# Altium schematic sheet Switch_RGB_Cherry.SchDoc
size A4; SheetNumber: 2; SheetTotal: 2
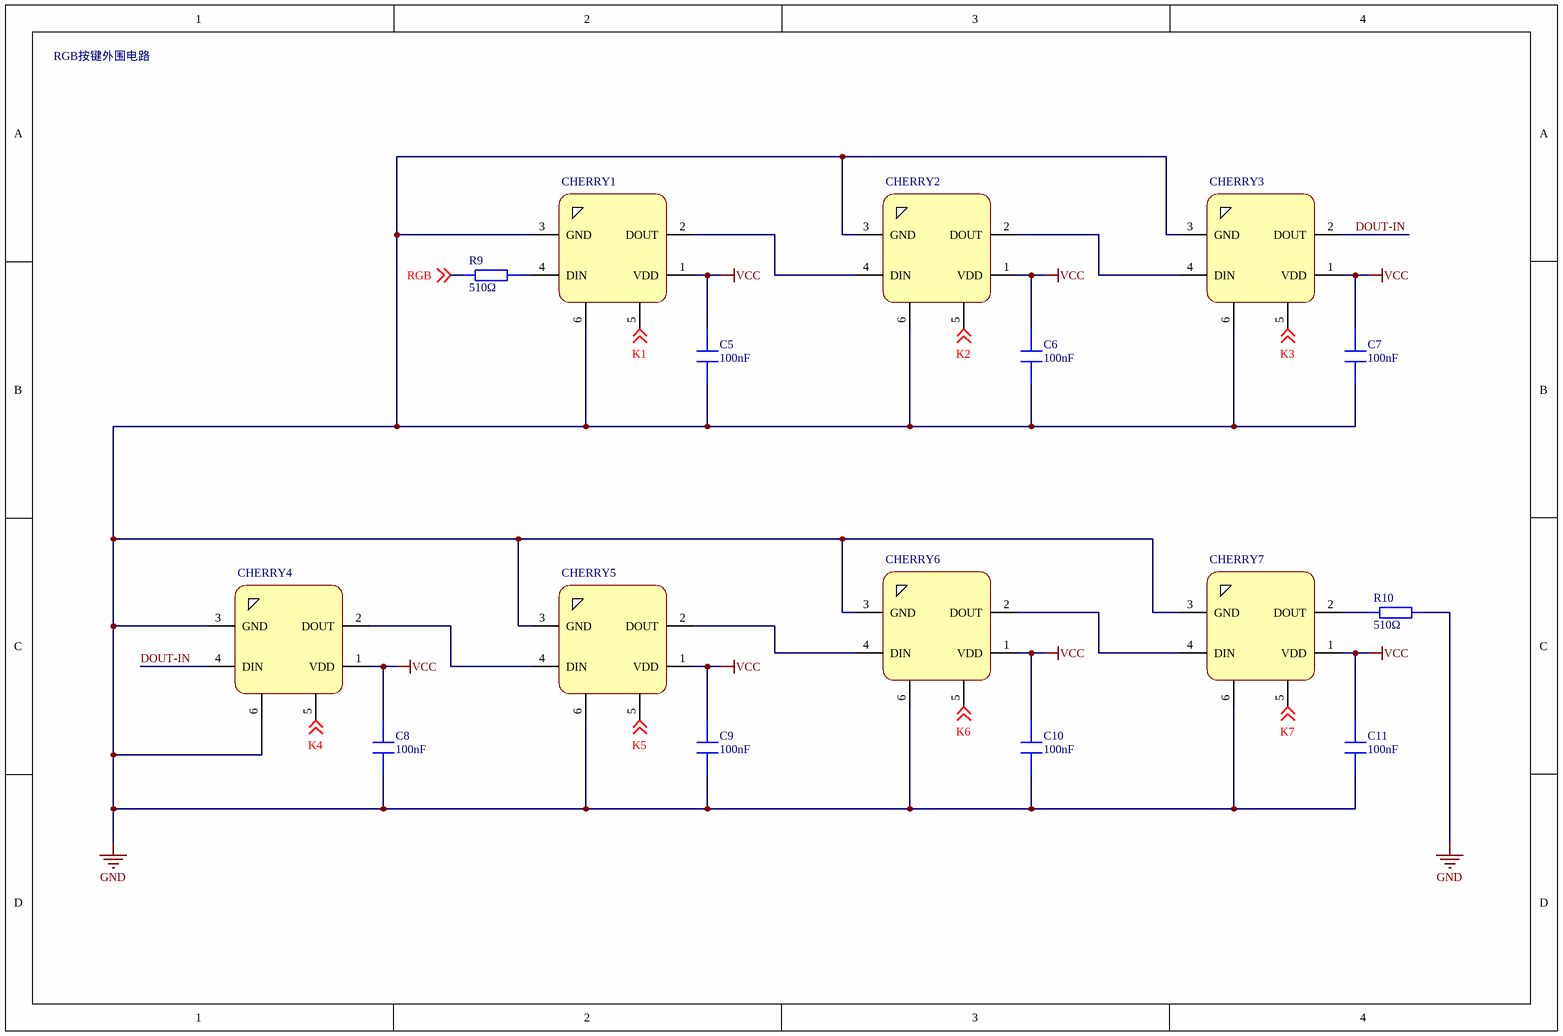
[diagram p0: Switch_RGB_Cherry.SchDoc]

## Parts
C5  100nF  [SM_C_0805]
C6  100nF  [SM_C_0805]
C7  100nF  [SM_C_0805]
C8  100nF  [SM_C_0805]
C9  100nF  [SM_C_0805]
C10  100nF  [SM_C_0805]
C11  100nF  [SM_C_0805]
CHERRY1  Cherry_RGB  [Cherry]  (value not drawn)
CHERRY2  Cherry_RGB  [Cherry]  (value not drawn)
CHERRY3  Cherry_RGB  [Cherry]  (value not drawn)
CHERRY4  Cherry_RGB  [Cherry]  (value not drawn)
CHERRY5  Cherry_RGB  [Cherry]  (value not drawn)
CHERRY6  Cherry_RGB  [Cherry]  (value not drawn)
CHERRY7  Cherry_RGB  [Cherry]  (value not drawn)
R9  510Ω  [SM_R_0805]
R10  510Ω  [SM_R_0805]

## Nets
GND: C5.1 C6.1 C7.1 C8.1 C9.1 C10.1 C11.1 CHERRY1.3(GND) CHERRY1.6(KI) CHERRY2.3(GND) CHERRY2.6(KI) CHERRY3.3(GND) CHERRY3.6(KI) CHERRY4.3(GND) CHERRY4.6(KI) CHERRY5.3(GND) CHERRY5.6(KI) CHERRY6.3(GND) CHERRY6.6(KI) CHERRY7.3(GND) CHERRY7.6(KI) R10.2
VCC: C5.2 C6.2 C7.2 C8.2 C9.2 C10.2 C11.2 CHERRY1.1(VDD) CHERRY2.1(VDD) CHERRY3.1(VDD) CHERRY4.1(VDD) CHERRY5.1(VDD) CHERRY6.1(VDD) CHERRY7.1(VDD)
DOUT-IN: CHERRY3.2(DOUT) CHERRY4.4(DIN)
K1: CHERRY1.5(KO) ; off-sheet K1
K2: CHERRY2.5(KO) ; off-sheet K2
K3: CHERRY3.5(KO) ; off-sheet K3
K4: CHERRY4.5(KO) ; off-sheet K4
K5: CHERRY5.5(KO) ; off-sheet K5
K6: CHERRY6.5(KO) ; off-sheet K6
K7: CHERRY7.5(KO) ; off-sheet K7
RGB: R9.1 ; off-sheet RGB
NetCHERRY1_2: CHERRY1.2(DOUT) CHERRY2.4(DIN)
NetCHERRY1_4: CHERRY1.4(DIN) R9.2
NetCHERRY2_2: CHERRY2.2(DOUT) CHERRY3.4(DIN)
NetCHERRY4_2: CHERRY4.2(DOUT) CHERRY5.4(DIN)
NetCHERRY5_2: CHERRY5.2(DOUT) CHERRY6.4(DIN)
NetCHERRY6_2: CHERRY6.2(DOUT) CHERRY7.4(DIN)
NetCHERRY7_2: CHERRY7.2(DOUT) R10.1

## Notes on the sheet
- RGB按键外围电路

## Library data of the parts
C5-C11 = C0805: 贴片电容
CHERRY1-CHERRY7 = Cherry_RGB: 樱花轴CHERRY
R9 R10 = R0805: 贴片电阻